# Altium project Gateway_ESP32.PrjPcb
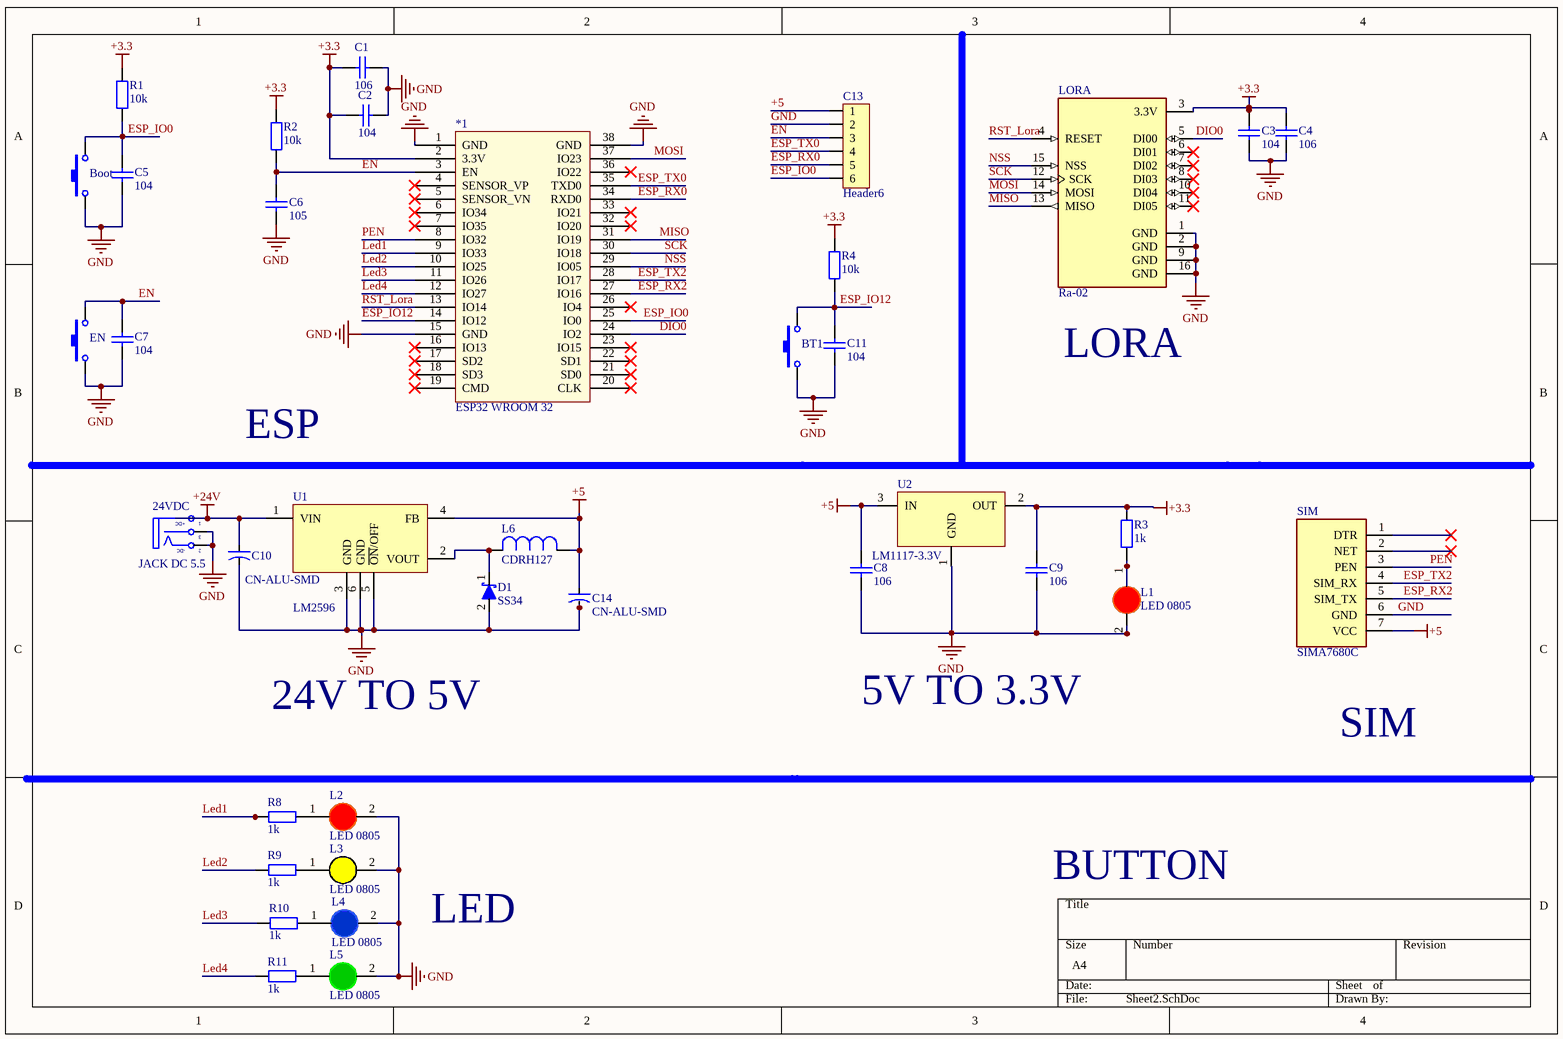
[diagram p0: Sheet2.SchDoc]
1 sheet, 37 parts. Net scope: global (net labels, ports and power ports of the same name join across sheets).
Board file: PCB2.PcbDoc

## Sheet Sheet2.SchDoc
size A4; SheetNumber: 1; SheetTotal: 1

### Parts
24VDC  JACK DC 5.5  [JACK DC 5.5]
*1  ESP32 WROOM 32  [ESP32-WROOM-32D]
Boot  Nut Nhan 2 Chan SMD 3x6x2.5  [Nut Nhan 2 Chan SMD 3x6x2.5]  (value not drawn)
BT1  Nut Nhan 2 Chan SMD 3x6x2.5  [Nut Nhan 2 Chan SMD 3x6x2.5]  (value not drawn)
C1  106  [tu 1206]
C2  104  [tu 1206]
C3  104  [tu 1206]
C4  106  [tu 1206]
C5  104  [tu 1206]
C6  105  [tu 1206]
C7  104  [tu 1206]
C8  106  [tu 1206]
C9  106  [tu 1206]
C10  CN-ALU-SMD  [CAP-ALU-SMD-H]
C11  104  [tu 1206]
C13  Header6  [HDR6]
C14  CN-ALU-SMD  [CAP-ALU-SMD-D]
D1  SS34  [DO-214AC]
EN  Nut Nhan 2 Chan SMD 3x6x2.5  [Nut Nhan 2 Chan SMD 3x6x2.5]  (value not drawn)
L1  LED 0805  [LED-1206-Red]
L2  LED 0805  [LED-1206-Red]
L3  LED 0805  [LED-1206-Yellow]
L4  LED 0805  [LED-1206-Blue]
L5  LED 0805  [LED-1206-Green]
L6  CDRH127  [33uH]
LORA  Ra-02  [Sx1278]
R1  10k  [tro smd 1206]
R2  10k  [tro smd 1206]
R3  1k  [Tro smd 1206]
R4  10k  [tro smd 1206]
R8  1k  [Tro smd 1206]
R9  1k  [Tro smd 1206]
R10  1k  [Tro smd 1206]
R11  1k  [Tro smd 1206]
SIM  SIMA7680C  [SIMA7680C]
U1  LM2596  [TO263-5]
U2  LM1117-3.3V  [SOT223]

### Nets
+3.3: *1.2(3.3V) C1.2 C2.2 C3.1 C4.1 C9.1 LORA.3(3.3V) R1.2 R2.2 R3.1 R4.2 U2.2(OUT)
+5: C8.1 C13.1 C14.1 L6.1 SIM.7(VCC) U1.4(FB) U2.3(IN)
+24V: 24VDC.1(T) C10.1 U1.1(VIN)
GND: 24VDC.2(TN) 24VDC.3(S) *1.1(GND) *1.15(GND) *1.38(GND) Boot.1 BT1.1 C1.1 C2.1 C3.2 C4.2 C5.2 C6.2 C7.2 C8.2 C9.2 C10.2 C11.2 C13.2 C14.2 D1.2(A) EN.1 L1.2(K) L2.2(K) L3.2(K) L4.2(K) L5.2(K) LORA.1(GND) LORA.2(GND) LORA.9(GND) LORA.16(GND) SIM.6(GND) U1.3(GND) U1.5(~{ON}/OFF) U1.6(GND) U2.1(GND)
DIO0: *1.24(IO2) LORA.5(DI00)
EN: *1.3(EN) C6.1 C7.1 C13.3 EN.2 R2.1
ESP_IO0: *1.25(IO0) Boot.2 C5.1 C13.6 R1.1
ESP_IO12: *1.14(IO12) BT1.2 C11.1 R4.1
ESP_RX0: *1.34(RXD0) C13.5
ESP_RX2: *1.27(IO16) SIM.5(SIM_TX)
ESP_TX0: *1.35(TXD0) C13.4
ESP_TX2: *1.28(IO17) SIM.4(SIM_RX)
Led1: *1.9(IO33) R8.2
Led2: *1.10(IO25) R9.2
Led3: *1.11(IO26) R10.2
Led4: *1.12(IO27) R11.2
MISO: *1.31(IO19) LORA.13(MISO)
MOSI: *1.37(IO23) LORA.14(MOSI)
NSS: *1.29(IO05) LORA.15(NSS)
PEN: *1.8(IO32) SIM.3(PEN)
RST_Lora: *1.13(IO14) LORA.4(RESET)
SCK: *1.30(IO18) LORA.12(SCK)
NetD1_1: D1.1(K) L6.2 U1.2(VOUT)
NetL1_1: L1.1(A) R3.2
NetL2_1: L2.1(A) R8.1
NetL3_1: L3.1(A) R9.1
NetL4_1: L4.1(A) R10.1
NetL5_1: L5.1(A) R11.1

Not connected (* = marked no-connect by the designer): *1 4(SENSOR_VP)* 5(SENSOR_VN)* 6(IO34)* 7(IO35)* 16(IO13)* 17(SD2)* 18(SD3)* 19(CMD)* 20(CLK)* 21(SD0)* 22(SD1)* 23(IO15)* 26(IO4)* 32(IO20)* 33(IO21)* 36(IO22)*; LORA 6(DI01)* 7(DI02)* 8(DI03)* 10(DI04)* 11(DI05)*; SIM 1(DTR)* 2(NET)*

### Notes on the sheet
- (near LORA) LORA
- ESP
- 24V TO 5V
- 5V TO 3.3V
- SIM
- BUTTON
- LED
- (in symbol JACK DC 5.5) +DC; -DC

### Library data of the parts
24VDC = JACK DC 5.5: Value: Jac DC
Boot BT1 EN = Nut Nhan 2 Chan SMD 3x6x2.5: Ma_Hang: MH001036; Ten: Nút Nhấn 2 Chân 3x6x2.5MM SMD
C1 C4 C8 C9 = Tu 1206 106 16V 20%: Dán; Don_Vi: Con; So_Chan: 2; Ten_Linh_Kien: Tụ 1206 106-10uF 20% 16V; Ma_Hang: MH004541; Chung_Loai: Dán; Kieu_Chan: *
C2 C3 C5 C7 C11 = Tu 1206 104 50V 20%: Dán; Don_Vi: Con; So_Chan: 2; Ten_Linh_Kien: Tụ 1206 104-0.1uF 20% 50V; Ma_Hang: MH004544; Chung_Loai: Dán; Kieu_Chan: *
C6 = Tu 1206 105 50V 20%: Dán; Don_Vi: Con; So_Chan: 2; Ten_Linh_Kien: Tụ 1206 105-1uF 20% 50V; Ma_Hang: MH004545; Chung_Loai: Dán; Kieu_Chan: *
C10 C14 = CN-ALU-SMD: Polarized Capacitor (Axial); Published: 8-Jun-2000; LatestRevisionDate: 17-Jul-2002; LatestRevisionNote: Re-released for DXP Platform.; PackageReference: POLAR0.8; Publisher: Altium Limited
C13 = Header6: Header IDC, 6 x 1 Pin Vertical 2.54mm Pitch (Non-Boxed, Male); Manufacturer: W¨¹rth Elektronik eiSos GmbH; partNo: 613002143121; ComponentLink1 Description: Manufacturer; ComponentLink2 Description: Datasheet; NoPins: 02; Created Date: 29 March 2013; ComponentLink1URL: http://www.we-online.com; ComponentLink2URL: http://katalog.we-online.de/em/datasheet/6130xx143121.pdf; Created by: Karrer Zheng
D1 = SS54: Diode Schottky 40 V 5A Surface Mount DO-214AC (SMA)
L1 L2 = LED 1206 Do: Dán; Don_Vi: Con; Ma_Hang: MH002334; Ten_Linh_Kien: LED1206 Màu Đỏ (Red); Ghi_Chu: *; Kieu_Chan: *; Chung_Loai: Dán
L3 = LED 1206 Vang: Dán; Don_Vi: Con; Ma_Hang: MH002331; Ten_Linh_Kien: LED1206 Màu Vàng (Yellow); Ghi_Chu: *; Kieu_Chan: *; Chung_Loai: Dán
L4 = LED 1206 Xanh Duong: Dán; Don_Vi: Con; Ma_Hang: MH002333; Ten_Linh_Kien: LED1206 Màu Xanh Dương (Blue); Ghi_Chu: *; Kieu_Chan: *; Chung_Loai: Dán
L5 = LED 1206 Xanh La: Dán; Don_Vi: Con; Ma_Hang: MH002947; Ten_Linh_Kien: LED1206 Màu Xanh Lá (Green); Ghi_Chu: *; Kieu_Chan: *; Chung_Loai: Dán
L6 = CDRH127: 33uH - Inductor 4.2 A
LORA = Ra-02: Lora sx1278
R1 R4 = Tro 1206 5% 1k: Dán; Don_Vi: Con; So_Chan: 2; Ten_Linh_Kien: Trở 1206 5% 1k; Ma_Hang: MH005904; Chung_Loai: Dán; Kieu_Chan: *
R2 = Tro 1206 1% 10k: Dán; Don_Vi: Con; So_Chan: 2; Ten_Linh_Kien: Trở 1206 1% 10k; Ma_Hang: MH005885; Chung_Loai: Dán; Kieu_Chan: *
R3 R8-R11 = Tro 1206 5% 390R: Dán; Don_Vi: Con; So_Chan: 2; Ten_Linh_Kien: Trở 1206 5% 390R; Ma_Hang: MH005927; Chung_Loai: Dán; Kieu_Chan: *
U1 = LM2596: 1A Regulator
U2 = LM1117: 800mA Low-Dropout Linear Regulator; Creator: Nguyen Ba Bien; Website: http://group3i.net